# Altium schematic sheet ESP8266.SchDoc
size A4
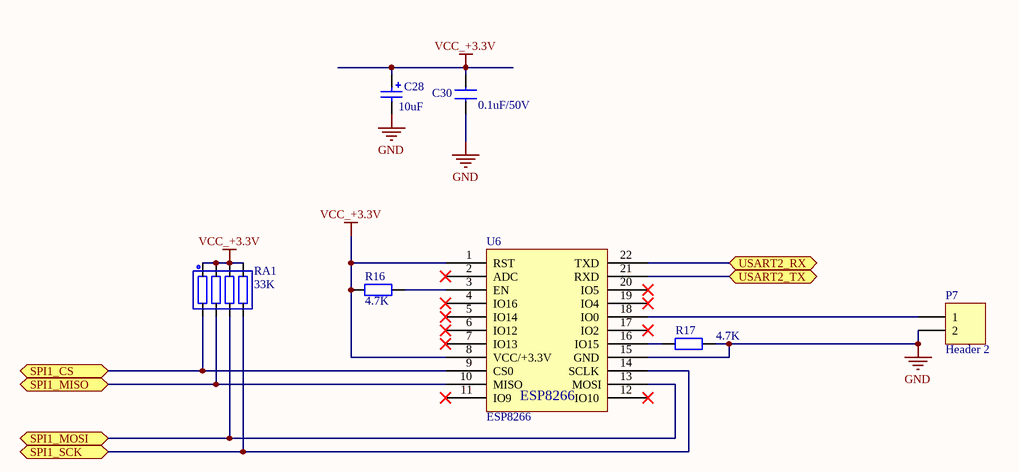
[diagram p0: ESP8266.SchDoc]

## Parts
C28  10uF  [CAPTANC]
C30  0.1uF/50V  [0603C]
P7  Header 2  [HDR1*2 - duplicate]
R16  4.7K  [0603R]
R17  4.7K  [0603R]
RA1  33K  [RES_PACK_SMD_E]
U6  ESP8266  [ESP8266]

## Ports
SPI1_CS, SPI1_MISO, SPI1_MOSI, SPI1_SCK, USART2_RX (bidir), USART2_TX (bidir)

## Nets
GND: C28.2 C30.2 P7.2 R17.2 U6.15(GND)
VCC_+3.3V: C28.1 C30.1 R16.1 RA1.1 RA1.2 RA1.3 RA1.4 U6.1(RST) U6.8(VCC/+3.3V)
SPI1_CS: RA1.8 U6.9(CS0) ; port SPI1_CS
SPI1_MISO: RA1.7 U6.10(MISO) ; port SPI1_MISO
SPI1_MOSI: RA1.6 U6.13(MOSI) ; port SPI1_MOSI
SPI1_SCK: RA1.5 U6.14(SCLK) ; port SPI1_SCK
USART2_RX: U6.22(TXD) ; port USART2_RX
USART2_TX: U6.21(RXD) ; port USART2_TX
NetP7_1: P7.1 U6.18(IO0)
NetR16_2: R16.2 U6.3(EN)
NetR17_1: R17.1 U6.16(IO15)

Not connected (* = marked no-connect by the designer): U6 2(ADC)* 4(IO16)* 5(IO14)* 6(IO12)* 7(IO13)* 11(IO9)* 12(IO10)* 17(IO2)* 19(IO4)* 20(IO5)*

## Library data of the parts
C28 = Cap Pol: Polarized Capacitor (Radial); Published: 8-Jun-2000; LatestRevisionDate: 17-Jul-2002; LatestRevisionNote: Re-released for DXP Platform.; Publisher: Altium Limited; Value: 10uF
C30 = CAP
P7 = Header 2: Header, 2-Pin; LatestRevisionDate: 17-Jul-2002; LatestRevisionNote: Re-released for DXP Platform.; Publisher: Altium Limited
R16 R17 = 0603R
RA1 = RESPACK4